# Altium schematic sheet TPA6120A.schdoc
size A2
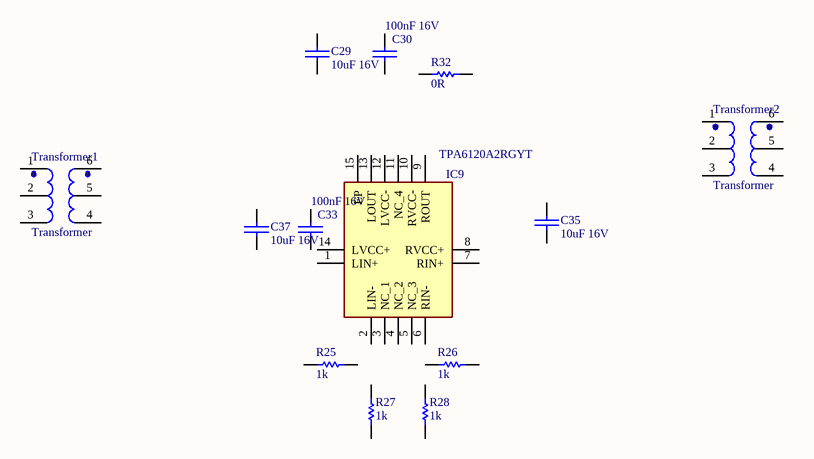
[diagram p0: TPA6120A.schdoc]

## Parts
C29  10uF 16V  [0603C]
C30  100nF 16V  [0402C]
C33  100nF 16V  [0402C]
C35  10uF 16V  [0603C]
C37  10uF 16V  [0603C]
IC9  TPA6120A2RGYT  [RGY-(S-PVQFN-N14)]
R25  1k  [0402R]
R26  1k  [0402R]
R27  1k  [0402R]
R28  1k  [0402R]
R32  0R  [0603R]
Transformer1  Transformer  [EE13]
Transformer2  Transformer  [EE13]

## Nets

Not connected (* = marked no-connect by the designer): C29 1 2; C30 1 2; C33 1 2; C35 1 2; C37 1 2; IC9 1(LIN+) 2(LIN-) 3(NC_1) 4(NC_2) 5(NC_3) 6(RIN-) 7(RIN+) 8(RVCC+) 9(ROUT) 10(RVCC-) 11(NC_4) 12(LVCC-) 13(LOUT) 14(LVCC+) 15(EP); R25 1 2; R26 1 2; R27 1 2; R28 1 2; R32 1 2; Transformer1 1 2 3 4 5 6; Transformer2 1 2 3 4 5 6

## Library data of the parts
C29 C35 C37 = CAP-NP
  C29: Parameter 1: *
C30 C33 = CAP-NP: Manufacturer 1: Samsung; Manufacturer Part Number 1: CL05B104KO5NNNC; Description 1: CAP CER 0.1UF 16V X7R 0402; Material: Ceramic; Tolerance: 10%; Dielectric: X7R; Supplier 1: LCSC; Supplier Part Number 1: C1525; Stock 1: 5012200; Pricing 1: 100=0.0023, 1000=0.002, 3000=0.0018, 10000=0.0017, 50000=0.0017, 100000=0.0017, 100=0.0021, 1000=0.0018, 3000=0.0017, 10000=0.0016, 50000=0.0016, 100000=0.0016, 100=0.0107, 1000=0.0094, 3000=0.0087, 10000=0.008, 50000=0.008, 100000=0.008, 100=0.0102, 1000=0.0089, 3000=0.0083, 10000=0.0077, 50000=0.0077, 100000=0.0077, 100=0.0014, 1000=0.0012, 3000=0.0011, 10000=0.001, 50000=0.001, 100000=0.001, 100=0.0012, 1000=0.0011, 3000=0.001, 10000=0.0009, 50000=0.0009, 100000=0.0009, 100=0.0124, 1000=0.0109, 3000=0.0101, 10000=0.0093, 50000=0.0093, 100000=0.0093, 100=0.1676, 1000=0.1466, 3000=0.1361, 10000=0.1257, 50000=0.1257, 100000=0.1257, 100=0.0066, 1000=0.0058, 3000=0.0054, 10000=0.005, 50000=0.005, 100000=0.005, 100=0.1289, 1000=0.1128, 3000=0.1048, 10000=0.0967, 50000=0.0967, 100000=0.0967, 100=0.0142, 1000=0.0125, 3000=0.0116, 10000=0.0107, 50000=0.0107, 100000=0.0107, 100=0.0022, 1000=0.0019, 3000=0.0018, 10000=0.0016, 50000=0.0016, 100000=0.0016, 100=0.0016, 1000=0.0014, 3000=0.0013, 10000=0.0012, 50000=0.0012, 100000=0.0012 (AUD); Mount: Surface Mount; Case/Package: 0402; Case Code (Metric): 1005; Case Code (Imperial): 0402; Contact Plating: Tin; Min Operating Temperature: -55°C; Max Operating Temperature: 125°C; Capacitance: 100nF; Packaging: Tape and Reel; Voltage Rating: 16V; Voltage Rating (DC): 16V; Package Quantity: 1; Voltage: 16V; Length: 1mm; Width: 0.02inch; Height 1: 0.5mm; Thickness: 0.022inch; Depth: 0.5mm; Radiation Hardening: No; Lead Free: Lead Free; ComponentLink1URL: http://www1.futureelectronics.com/doc/SAMSUNG%20PASSIVE/CL05B104KQ5NNNC.pdf?src-supplier=Future+Electronics; ComponentLink1Description: http://www1.futureelectronics.com/doc/SAMSUNG%20PASSIVE/CL05B104KQ5NNNC.pdf?src-supplier=Future+Electronics; ComponentLink2URL: https://www.verical.com/server-webapp/html/getDatasheet?partID=359683&src-supplier=Verical; ComponentLink2Description: https://www.verical.com/server-webapp/html/getDatasheet?partID=359683&src-supplier=Verical; ComponentLink3URL: https://www.distrelec.biz/Web/Downloads/_e/ng/MLCC_CatalogDownload2013_ENG.pdf?mime=application%2Fpdf&src-supplier=Distrelec; ComponentLink3Description: https://www.distrelec.biz/Web/Downloads/_e/ng/MLCC_CatalogDownload2013_ENG.pdf?mime=application%2Fpdf&src-supplier=Distrelec; ComponentLink4URL: https://produktinfo.conrad.com/datenblaetter/450000-474999/458718-da-01-en-VS_KONDENSATOR_0402.pdf?src-supplier=Conrad; ComponentLink4Description: https://produktinfo.conrad.com/datenblaetter/450000-474999/458718-da-01-en-VS_KONDENSATOR_0402.pdf?src-supplier=Conrad
IC9 = TPA6120A2RGYT: 耳放芯片; Manufacturer_Name: Texas Instruments; Datasheet Link: http://www.ti.com/lit/gpn/tpa6120a2; Manufacturer_Part_Number: TPA6120A2RGYT; Arrow Part Number: TPA6120A2RGYT; Arrow Price/Stock: https://www.arrow.com/en/products/tpa6120a2rgyt/texas-instruments; Mouser Part Number: 595-TPA6120A2RGYT; Mouser Price/Stock: https://www.mouser.co.uk/ProductDetail/Texas-Instruments/TPA6120A2RGYT?qs=bZA2O%252B%252B1GJuCTwjuP6NvCw%3D%3D
R25-R28 R32 = RES
Transformer1 Transformer2 = Transformer: BOURNS 600ohms 1:1 Audio &Signal Transformers